# EAGLE design Example_Latching_Interlock (EAGLE 5.11)
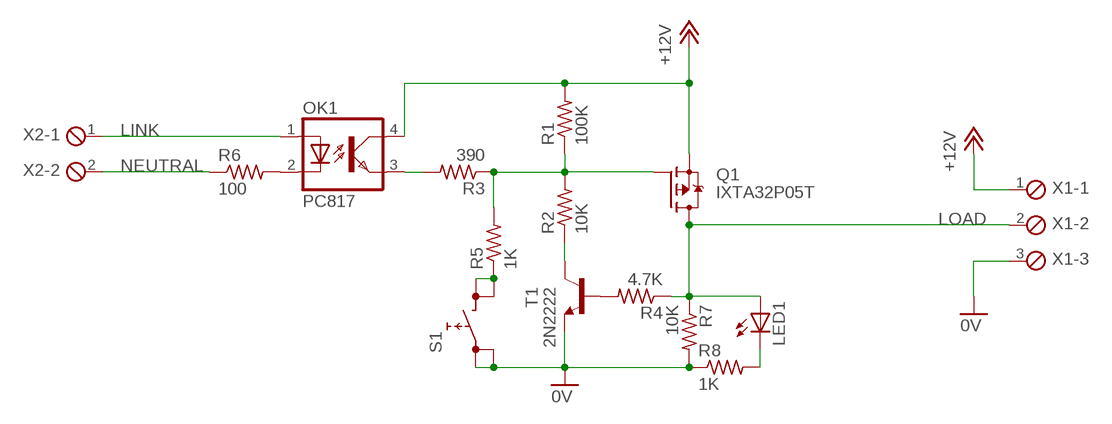
[diagram p0: schematic, sheet 1]

## Parts
LED1  LED5MM  [LED5MM]
OK1  PC817  [DIL04]
Q1  IXTA32P05T  SPB80P06P  [TO263]
R1  100K  R-US_0204/7  [0204/7]
R2  10K  R-US_0204/7  [0204/7]
R3  390  R-US_0204/7  [0204/7]
R4  4.7K  R-US_0204/7  [0204/7]
R5  1K  R-US_0204/7  [0204/7]
R6  100  R-US_0204/7  [0204/7]
R7  10K  R-US_0204/7  [0204/7]
R8  1K  R-US_0204/7  [0204/7]
S1  REKN  [REKN]
T1  2N2222  [TO18]
X1  MPT3  [3POL254]
X2  MPT2  [2POL254]

## Nets
0V: R7.2 R8.1 S1.0A S1.0B T1.1(E) X1.3
+12V: OK1.4(COL) Q1.2(S) R1.2 X1.1
LINK: OK1.1(A) X2.1
LOAD: LED1.A Q1.3(D) R4.1 R7.1 X1.2
N$1: OK1.2(C) R6.2
N$2: R2.1 T1.3(C)
N$3: R4.2 T1.2(B)
N$5: OK1.3(EMIT) R3.2
N$8: Q1.1(G) R1.1 R2.2 R3.1 R5.2
N$10: LED1.K(C) R8.2
N$11: R5.1 S1.1A S1.1B
NEUTRAL: R6.1 X2.2

## Library data of the parts
LED1 = led:LED: LED OSRAM: - CHIPLED LG R971, LG N971, LY N971, LG Q971, LY Q971, LO R971, LY R971 LH N974, LH R974 LS Q976, LO Q976, LY Q976 LO Q996 - Hyper CHIPLED LW Q18S LB Q993, LB Q99A, LB R99A - SideLED LS A670, LO A670, LY A670, LG A670, LP A670 LB A673, LV A673, LT A673, LW A673 LH A674 LY A675 LS A676, LA A676, LO A676, LY A676, LW A676 LS A679, LY A679, LG A679 - Hyper Micro SIDELED® LS Y876, LA Y876, LO Y876, LY Y876 LT Y87S - SmartLED LW L88C, LW L88S LB L89C, LB L89S, LG L890 LS L89K, LO L89K, LY L89K LS L896, LA L896, LO L896, LY L896 - TOPLED LS T670, LO T670, LY T670, LG T670, LP T670 LSG T670, LSP T670, LSY T670, LOP T670, LYG T670 LG T671, LOG T671, LSG T671 LB T673, LV T673, LT T673, LW T673 LH T674 LS T676, LA T676, LO T676, LY T676, LB T676, LH T676, LSB T676, LW T676 LB T67C, LV T67C, LT T67C, LS T67K, LO T67K, LY T67K, LW E67C LS E67B, LA E67B, LO E67B, LY E67B, LB E67C, LV E67C, LT E67C LW T67C LS T679, LY T679, LG T679 LS T770, LO T770, LY T770, LG T770, LP T770 LB T773, LV T773, LT T773, LW T773 LH T774 LS E675, LA E675, LY E675, LS T675 LS T776, LA T776, LO T776, LY T776, LB T776 LHGB T686 LT T68C, LB T68C - Hyper Mini TOPLED® LB M676 - Mini TOPLED Santana® LG M470 LS M47K, LO M47K, LY M47K Source: http://www.osram.convergy.de LUXEON: - LUMILED® LXK2-PW12-R00, LXK2-PW12-S00, LXK2-PW14-U00, LXK2-PW14-V00 LXK2-PM12-R00, LXK2-PM12-S00, LXK2-PM14-U00 LXK2-PE12-Q00, LXK2-PE12-R00, LXK2-PE12-S00, LXK2-PE14-T00, LXK2-PE14-U00 LXK2-PB12-K00, LXK2-PB12-L00, LXK2-PB12-M00, LXK2-PB14-N00, LXK2-PB14-P00, LXK2-PB14-Q00 LXK2-PR12-L00, LXK2-PR12-M00, LXK2-PR14-Q00, LXK2-PR14-R00 LXK2-PD12-Q00, LXK2-PD12-R00, LXK2-PD12-S00 LXK2-PH12-R00, LXK2-PH12-S00 LXK2-PL12-P00, LXK2-PL12-Q00, LXK2-PL12-R00 Source: www.luxeon.com KINGBRIGHT: KA-3528ASYC Source: www.kingbright.com
OK1 = optocoupler:PC817: SHARP OPTO COUPLER; MPN: PC817X4J000F; OC_FARNELL: 9707727; OC_NEWARK: 97K7059
Q1 = transistor-fet:SPB80P06P: SIPMOS (R) Power-Transistor P-Channel, Enhancement mode Source: http://www.infineon.com/upload/Document/cmc_upload/documents/011/3685/SPP80P06P.pdf
R1-R8 = rcl:R-US_: RESISTOR, American symbol
S1 = switch:REKN: PUSH SWITCH ITT-Cannon-Cannon
T1 = transistor:2N2222: NPN TRANSISTOR
X1 = con-phoenix-254:MPT3: PHOENIX CONNECTOR; OC_FARNELL: unknown; OC_NEWARK: unknown
X2 = con-phoenix-254:MPT2: PHOENIX CONNECTOR; OC_FARNELL: unknown; OC_NEWARK: unknown

## Board
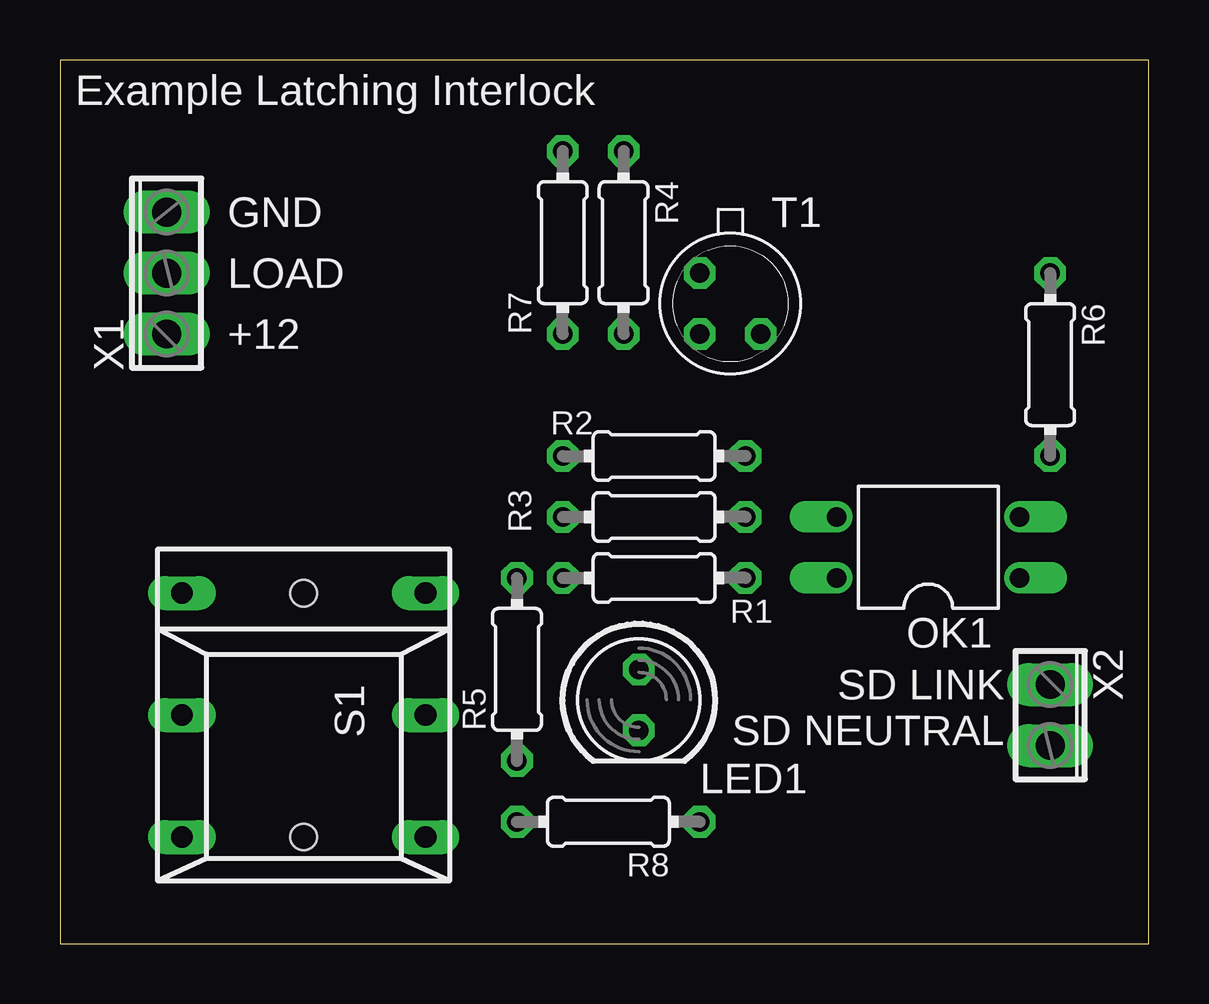
[diagram p1: board, top side]
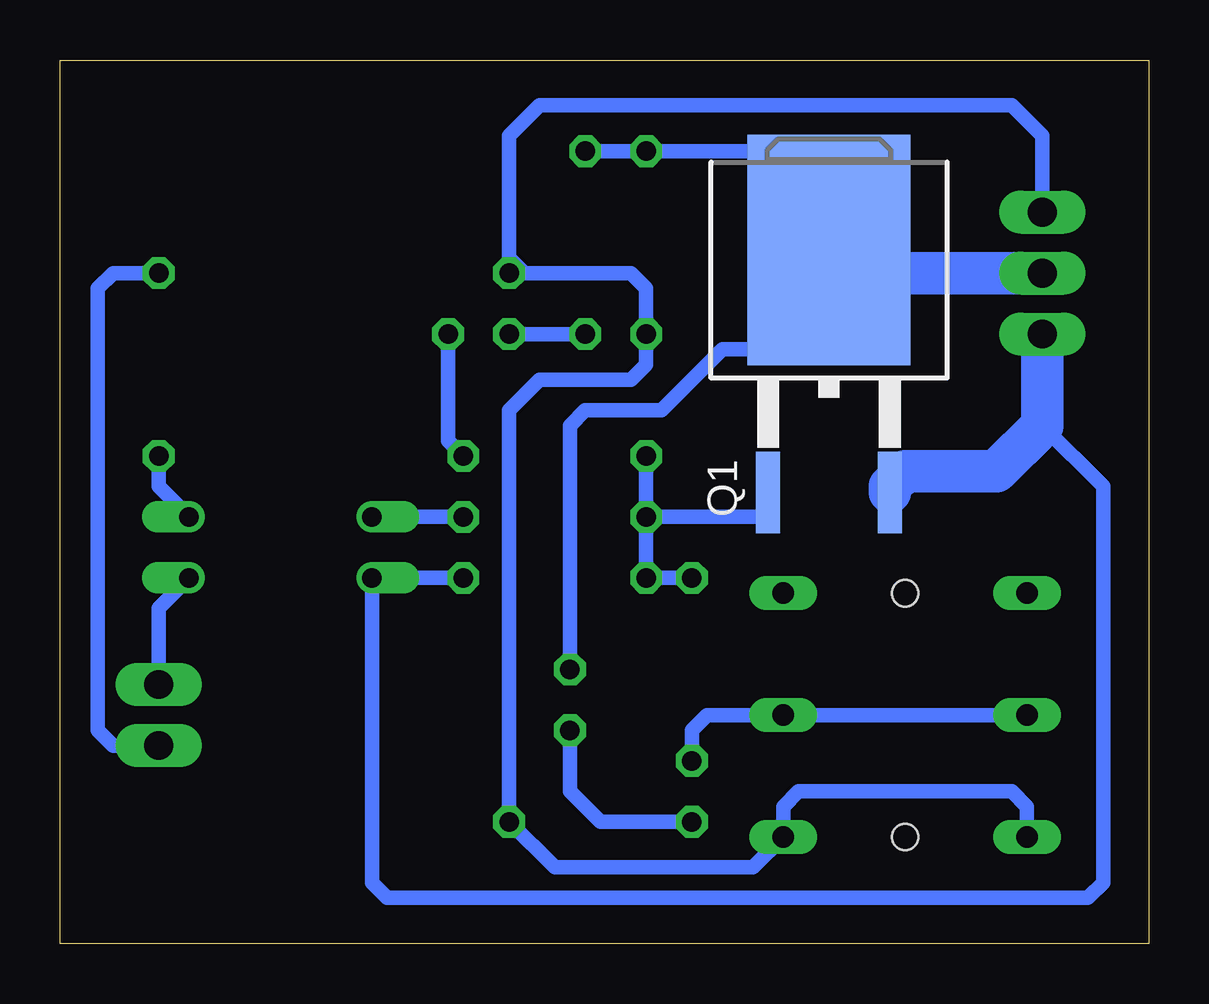
[diagram p2: board, bottom side, seen from below]

Size 45.39 x 36.82 mm. Coordinates in mm from the lower left corner, seen from the top.
Outline: 0,0 45.39,0 45.39,36.82 0,36.82 0,0
Copper layers (1*16): Top 0.035mm / dielectric 1.5mm / Bottom 0.035mm
Design rules "default": minimum track width 10mil, minimum drill 24mil, track to track 8mil, track to pad 8mil, pad to pad 8mil, via to via 8mil, smd to smd 8mil, copper to edge 40mil, drill to drill 8mil, minimum pad ring 10mil, minimum via ring 8mil, stop-mask expansion 4mil, vias tented up to drill 0mil, thermal gap 10mil
tKeepout: area 33.7,1.9 to 38.7,35.6
bKeepout: area 33.7,1.9 to 38.7,35.6

### Footprints (pad centres in the part's own frame; a part is rotated, then mirrored left to right if it is on the bottom)
LED5MM = drill 0.813 octagon: A -1.27,0; K 1.27,0
DIL04 = drill 0.813 offset: 1 -1.27,-3.81; 2 1.27,-3.81; 3 1.27,3.81; 4 -1.27,3.81
TO263 = smd 1 x 3.4: 1 -2.54,-6.6; 2 2.54,-6.6 | smd 6.8 x 9.6: 3 0,3.5
0204/7 = drill 0.813 octagon: 1 -3.81,0; 2 3.81,0
REKN = drill 0.9 long: 0A 5.08,5.08; 0B 5.08,-5.08; 1A 0,5.08; 1B 0,-5.08; A -5.08,5.08; B -5.08,-5.08 | hole 1.1: -5.08,0; 5.08,0
TO18 = drill 0.813 octagon: 1 -1.27,-1.27; 2 1.27,-1.27; 3 1.27,1.27
3POL254 = drill 1.2 long: 1 -2.54,0; 2 0,0; 3 2.54,0
2POL254 = drill 1.2 long: 1 -1.27,0; 2 1.27,0

### Placement (x,y rotation side)
LED1  24.13,10.16 270 top
OK1  36.2,16.51 90 top
Q1  13.33,25.4 0 bottom
R1  24.77,15.24 0 top
R2  24.77,20.32 180 top
R3  24.77,17.78 0 top
R4  23.5,29.21 270 top
R5  19.05,11.43 90 top
R6  41.27,24.13 270 top
R7  20.96,29.21 270 top
R8  22.86,5.08 180 top
S1  10.16,9.53 270 top
T1  27.94,26.67 270 top
X1  4.45,27.94 90 top
X2  41.27,9.53 270 top

### Tracks (layer width: path | path; a pad name or v marks a point on that pad's centre or on a via)
0V
  Bottom 0.61: 26.04,27.94 21.59,27.94 20.96,27.3 R7.2 20.96,24.13 21.59,23.5 25.4,23.5 26.67,22.23 R8.1 24.77,3.17 16.51,3.17 S1.0A 15.24,5.71 14.61,6.35 5.71,6.35 5.08,5.71 S1.0B | 26.04,27.94 T1.1 | X1.3 4.45,33.66 5.71,34.92 25.4,34.92 26.67,33.66 26.67,28.57 26.04,27.94
+12V
  Bottom 0.61: 4.45,21.59 1.91,19.05 1.91,2.54 2.54,1.91 31.75,1.91 32.38,2.54 OK1.4 R1.2
  Bottom 1.778: Q1.2 10.79,19.05 10.16,19.68 6.35,19.68 4.45,21.59 X1.1
LINK
  Bottom 0.61: X2.1 41.27,13.97 OK1.1
LOAD
  Bottom 0.61: Q1.3 13.33,31.11 15.24,33.02 R4.1 R7.1 | LED1.A 24.13,21.59 23.5,22.23 20.32,22.23 17.78,24.77 14.61,24.77 12.7,26.67 12.7,27.94
  Bottom 1.778: X1.2 12.7,27.94 13.33,28.57 Q1.3
N$1
  Bottom 0.61: R6.2 41.27,19.05 OK1.2
N$2
  Bottom 0.61: T1.3 29.21,20.95 R2.1
N$3
  Bottom 0.61: R4.2 T1.2
N$5
  Bottom 0.61: R3.2 OK1.3
N$8
  Bottom 0.61: R3.1 R1.1 R5.2 | R3.1 15.88,17.78 Q1.1 | R3.1 R2.2
N$10
  Bottom 0.61: LED1.K 24.13,6.35 22.86,5.08 R8.2
N$11
  Bottom 0.61: S1.1B S1.1A 18.42,9.53 19.05,8.89 R5.1
NEUTRAL
  Bottom 0.61: X2.2 43.18,8.26 43.81,8.89 43.81,27.3 43.18,27.94 R6.1

### Text on the board
tPlace: Example Latching Interlock | GND | LOAD | +12 | SD LINK | SD NEUTRAL